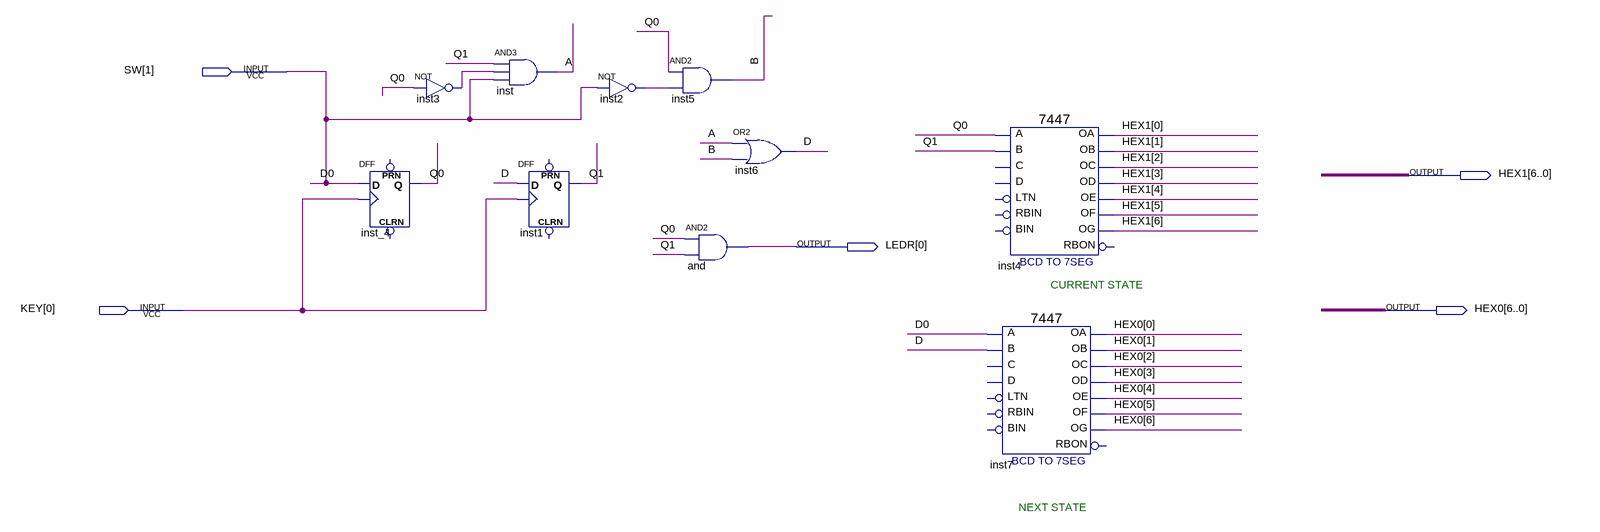
[diagram p0: schematic sheet]
// Quartus schematic moore.bdf as structural Verilog: 10 symbols, 5 pins
module moore (
  input  [1:1] SW,
  input  [0:0] KEY,
  output [6:0] HEX1,
  output [0:0] LEDR,
  output [6:0] HEX0
);

  wire A, B, D, inst2_out, inst3_out, Q0, Q1;

  DFF inst_4 (.CLK(KEY[0]), .D(SW[1]), .Q(Q0));  // open: CLRN, PRN
  not inst3 (inst3_out, Q0);
  and inst (A, Q1, inst3_out, SW[1]);
  DFF inst1 (.CLK(KEY[0]), .D(D), .Q(Q1));  // open: CLRN, PRN
  not inst2 (inst2_out, SW[1]);
  and inst5 (B, Q0, inst2_out);
  and \and  (LEDR[0], Q0, Q1);
  or inst6 (D, A, B);
  \7447  inst4 (
    .B(Q1), .A(Q0), .OB(HEX1[1]), .OC(HEX1[2]), .OE(HEX1[4]), .OD(HEX1[3]), .OF(HEX1[5]), .OG(HEX1[6]),
    .OA(HEX1[0]));  // open: LTN, C, D, RBIN, BIN, RBON
  \7447  inst7 (
    .B(D), .A(SW[1]), .OB(HEX0[1]), .OC(HEX0[2]), .OE(HEX0[4]), .OD(HEX0[3]), .OF(HEX0[5]), .OG(HEX0[6]),
    .OA(HEX0[0]));  // open: LTN, C, D, RBIN, BIN, RBON

  // Other names for the same wires on the sheet: D0 = SW[1]

  // Notes on the sheet:
  //   CURRENT STATE
  //   NEXT STATE
endmodule
